# EAGLE schematic Navigationmark1 (EAGLE 9.6.2)
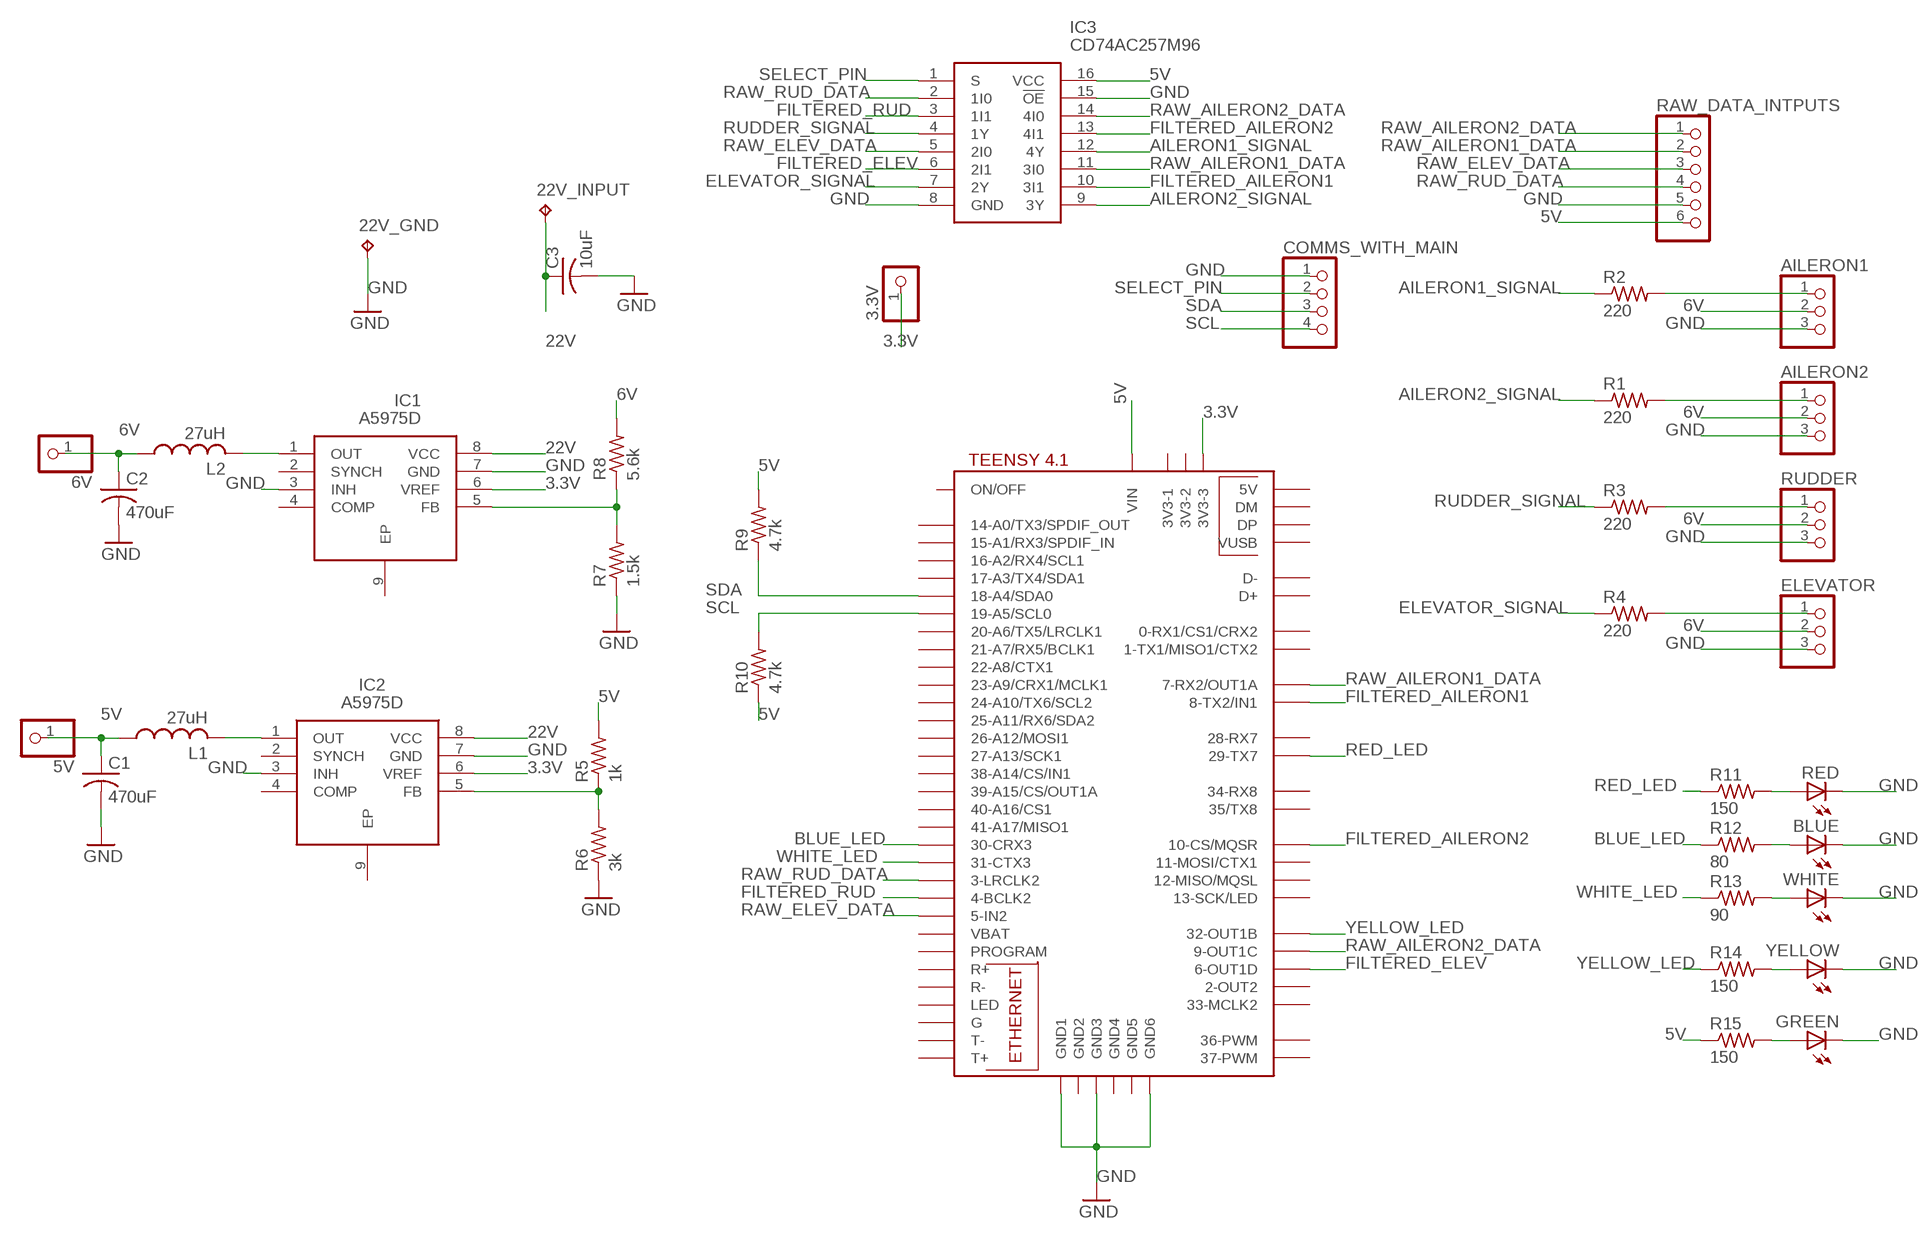
[diagram p0: schematic, sheet 1]

## Parts
3.3V  PINHD-1X1  [1X01]
5V  PINHD-1X1  [1X01]
6V  PINHD-1X1  [1X01]
22V_GND  TPPAD1-17Y  [P1-17Y]
22V_INPUT  TPPAD1-17Y  [P1-17Y]
AILERON1  PINHD-1X3  [1X03]
AILERON2  PINHD-1X3  [1X03]
BLUE  LED3MM  [LED3MM]
C1  470uF  C-US075-032X103  [C075-032X103]
C2  470uF  C-US075-032X103  [C075-032X103]
C3  10uF  C-US075-032X103  [C075-032X103]
COMMS_WITH_MAIN  PINHD-1X4  [1X04]
ELEVATOR  PINHD-1X3  [1X03]
GREEN  LED3MM  [LED3MM]
IC1  A5975D  [SOIC127P600X170-9N]
IC2  A5975D  [SOIC127P600X170-9N]
IC3  CD74AC257M96  [SOIC127P600X175-16N]
L1  27uH  L-US0207/10  [0207/10]
L2  27uH  L-US0207/10  [0207/10]
R1  220  R-US_0204/7  [0204/7]
R2  220  R-US_0204/7  [0204/7]
R3  220  R-US_0204/7  [0204/7]
R4  220  R-US_0204/7  [0204/7]
R5  1k  R-US_0204/7  [0204/7]
R6  3k  R-US_0204/7  [0204/7]
R7  1.5k  R-US_0204/7  [0204/7]
R8  5.6k  R-US_0204/7  [0204/7]
R9  4.7k  R-US_0204/7  [0204/7]
R10  4.7k  R-US_0204/7  [0204/7]
R11  150  R-US_0204/7  [0204/7]
R12  80  R-US_0204/7  [0204/7]
R13  90  R-US_0204/7  [0204/7]
R14  150  R-US_0204/7  [0204/7]
R15  150  R-US_0204/7  [0204/7]
RAW_DATA_INTPUTS  PINHD-1X6  [1X06]
RED  LED3MM  [LED3MM]
RUDDER  PINHD-1X3  [1X03]
U$1  TEENSY41  [TEENSY41]
WHITE  LED3MM  [LED3MM]
YELLOW  LED3MM  [LED3MM]

## Nets
3.3V: 3.3V.1 IC1.6(VREF) IC2.6(VREF) U$1.3V3-3
5V: 5V.1 C1.1 IC3.16(VCC) L1.1 R5.2 R9.2 R10.1 R15.1 RAW_DATA_INTPUTS.6 U$1.VIN
6V: 6V.1 AILERON1.2 AILERON2.2 C2.1 ELEVATOR.2 L2.1 R8.2 RUDDER.2
22V: 22V_INPUT.TP C3.1 IC1.8(VCC) IC2.8(VCC)
AILERON1_SIGNAL: IC3.12(4Y) R2.1
AILERON2_SIGNAL: IC3.9(3Y) R1.1
BLUE_LED: R12.1 U$1.30-CRX3
ELEVATOR_SIGNAL: IC3.7(2Y) R4.1
FILTERED_AILERON1: IC3.10(3I1) U$1.8-TX2/IN1
FILTERED_AILERON2: IC3.13(4I1) U$1.10-CS\MQSR(10-CS/MQSR)
FILTERED_ELEV: IC3.6(2I1) U$1.6-OUT1D
FILTERED_RUD: IC3.3(1I1) U$1.4-BCLK2
GND: 22V_GND.TP AILERON1.3 AILERON2.3 BLUE.K(C) C1.2 C2.2 C3.2 COMMS_WITH_MAIN.1 ELEVATOR.3 GREEN.K(C) IC1.3(INH) IC1.7(GND) IC2.3(INH) IC2.7(GND) IC3.8(GND) IC3.15(!OE) R6.1 R7.1 RAW_DATA_INTPUTS.5 RED.K(C) RUDDER.3 U$1.GND1 U$1.GND3 U$1.GND6 WHITE.K(C) YELLOW.K(C)
N$1: AILERON1.1 R2.2
N$2: GREEN.A R15.2
N$4: AILERON2.1 R1.2
N$7: R3.2 RUDDER.1
N$8: IC1.1(OUT) L2.2
N$9: R11.2 RED.A
N$10: ELEVATOR.1 R4.2
N$11: IC2.1(OUT) L1.2
N$12: IC2.5(FB) R5.1 R6.2
N$14: IC1.5(FB) R7.2 R8.1
N$15: BLUE.A R12.2
N$16: R13.2 WHITE.A
N$17: R14.2 YELLOW.A
RAW_AILERON1_DATA: IC3.11(3I0) RAW_DATA_INTPUTS.2 U$1.7-RX2/OUT1A
RAW_AILERON2_DATA: IC3.14(4I0) RAW_DATA_INTPUTS.1 U$1.9-OUT1C
RAW_ELEV_DATA: IC3.5(2I0) RAW_DATA_INTPUTS.3 U$1.5-IN2
RAW_RUD_DATA: IC3.2(1I0) RAW_DATA_INTPUTS.4 U$1.3-LRCLK2
RED_LED: R11.1 U$1.29-TX7
RUDDER_SIGNAL: IC3.4(1Y) R3.1
SCL: COMMS_WITH_MAIN.4 R10.2 U$1.19-A5/SCL0
SDA: COMMS_WITH_MAIN.3 R9.1 U$1.18-A4/SDA0
SELECT_PIN: COMMS_WITH_MAIN.2 IC3.1(S)
WHITE_LED: R13.1 U$1.31-CTX3
YELLOW_LED: R14.1 U$1.32-OUT1B
Unconnected: IC1.2(SYNCH) IC1.4(COMP) IC1.9(EP) IC2.2(SYNCH) IC2.4(COMP) IC2.9(EP) U$1.0-RX1/CS1/CRX2 U$1.1-TX1/MISO1/CTX2 U$1.2-OUT2 U$1.3V3-1 U$1.3V3-2 U$1.11-MOSI/CTX1 U$1.12-MISO/MQSL U$1.13-SCK/LED U$1.14-A0/TX3/SPDIF_OUT U$1.15-A1/RX3/SPDIF_IN U$1.16-A2/RX4/SCL1 U$1.17-A3/TX4/SDA1 U$1.20-A6/TX5/LRCLK1 U$1.21-A7/RX5/BCLK1 U$1.22-A8/CTX1 U$1.23-A9/CRX1/MCLK1 U$1.24-A10/TX6/SCL2 U$1.25-A11/RX6/SDA2 U$1.26-A12/MOSI1 U$1.27-A13/SCK1 U$1.28-RX7 U$1.33-MCLK2 U$1.34-RX8 U$1.35-TX8(35/TX8) U$1.36-PWM U$1.37-PWM U$1.38-A14/CS/IN1 U$1.39-A15/CS/OUT1A U$1.40-A16/CS1 U$1.41-A17/MISO1 U$1.+5V(5V) U$1.D+ U$1.D- U$1.DM U$1.DP U$1.G U$1.GND2 U$1.GND4 U$1.GND5 U$1.LED U$1.ON/OFF U$1.PROGRAM U$1.R+ U$1.R- U$1.T+ U$1.T- U$1.VBAT U$1.VUSB

## Library data of the parts
3.3V 5V 6V = pinhead:PINHD-1X1: PIN HEADER
22V_GND 22V_INPUT = testpad:TP: Test pad
AILERON1 AILERON2 ELEVATOR RUDDER = pinhead:PINHD-1X3: PIN HEADER
BLUE GREEN RED WHITE YELLOW = adafruit:LED: LED OSRAM: - CHIPLED LG R971, LG N971, LY N971, LG Q971, LY Q971, LO R971, LY R971 LH N974, LH R974 LS Q976, LO Q976, LY Q976 LO Q996 - Hyper CHIPLED LW Q18S LB Q993, LB Q99A, LB R99A - SideLED LS A670, LO A670, LY A670, LG A670, LP A670 LB A673, LV A673, LT A673, LW A673 LH A674 LY A675 LS A676, LA A676, LO A676, LY A676, LW A676 LS A679, LY A679, LG A679 - Hyper Micro SIDELED® LS Y876, LA Y876, LO Y876, LY Y876 LT Y87S - SmartLED LW L88C, LW L88S LB L89C, LB L89S, LG L890 LS L89K, LO L89K, LY L89K LS L896, LA L896, LO L896, LY L896 - TOPLED LS T670, LO T670, LY T670, LG T670, LP T670 LSG T670, LSP T670, LSY T670, LOP T670, LYG T670 LG T671, LOG T671, LSG T671 LB T673, LV T673, LT T673, LW T673 LH T674 LS T676, LA T676, LO T676, LY T676, LB T676, LH T676, LSB T676, LW T676 LB T67C, LV T67C, LT T67C, LS T67K, LO T67K, LY T67K, LW E67C LS E67B, LA E67B, LO E67B, LY E67B, LB E67C, LV E67C, LT E67C LW T67C LS T679, LY T679, LG T679 LS T770, LO T770, LY T770, LG T770, LP T770 LB T773, LV T773, LT T773, LW T773 LH T774 LS E675, LA E675, LY E675, LS T675 LS T776, LA T776, LO T776, LY T776, LB T776 LHGB T686 LT T68C, LB T68C - Hyper Mini TOPLED® LB M676 - Mini TOPLED Santana® LG M470 LS M47K, LO M47K, LY M47K Source: http://www.osram.convergy.de/
C1-C3 = adafruit:C-US: CAPACITOR, American symbol
COMMS_WITH_MAIN = pinhead:PINHD-1X4: PIN HEADER
IC1 IC2 = A5975D:A5975D: STMICROELECTRONICS - A5975D - DC/DC Boost Regulator, Adjustable, AEC-Q100, 4V to 36V In, 1.235V to 35V/3A Out, 250 kHz, PowerSO-8 Source: Datasheet <https://www.st.com/resource/en/datasheet/a5975d.pdf>; ARROW_PART_NUMBER: A5975D; ARROW_PRICE-STOCK: https://www.arrow.com/en/products/a5975d/stmicroelectronics; DESCRIPTION: STMICROELECTRONICS - A5975D - DC/DC Boost Regulator, Adjustable, AEC-Q100, 4V to 36V In, 1.235V to 35V/3A Out, 250 kHz, PowerSO-8; HEIGHT: 1.7mm; MANUFACTURER_NAME: STMicroelectronics; MANUFACTURER_PART_NUMBER: A5975D; MOUSER_PART_NUMBER: 511-A5975D; MOUSER_PRICE-STOCK: https://www.mouser.co.uk/ProductDetail/STMicroelectronics/A5975D?qs=LYO3r17CQdO66PebjUe%2FOA%3D%3D
IC3 = CD74AC257M96:CD74AC257M96: Quad 2-Input Non-Inverting Multiplexers with 3-State Outputs Source: Datasheet <https://www.ti.com/lit/gpn/cd74ac257?HQS=ti-null-null-sf-df-pf-sep-wwe&DCM=yes>; DESCRIPTION: Quad 2-Input Non-Inverting Multiplexers with 3-State Outputs; HEIGHT: 1.75mm; MANUFACTURER_NAME: Texas Instruments; MANUFACTURER_PART_NUMBER: CD74AC257M96; MOUSER_PART_NUMBER: 595-CD74AC257M96; MOUSER_PRICE-STOCK: https://www.mouser.com/Search/Refine.aspx?Keyword=595-CD74AC257M96
L1 L2 = rcl:L-US: INDUCTOR, American symbol; SPICEPREFIX: L
R1-R15 = adafruit:R-US_: RESISTOR, American symbol
RAW_DATA_INTPUTS = pinhead:PINHD-1X6: PIN HEADER
U$1 = teensy:TEENSY41